# Altium schematic sheet Memory.SchDoc: QSPI
size A4; SheetNumber: 3; SheetTotal: 5; Time: C2S Memory
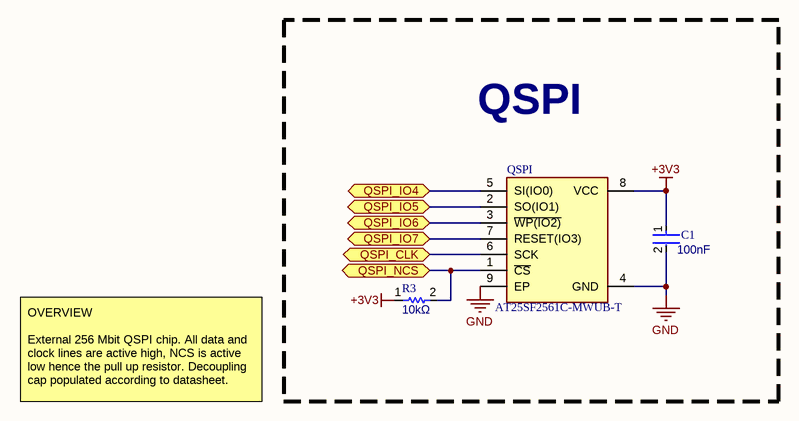
[diagram p0: Memory.SchDoc]

## Parts
C1  value 100nF  [FP-GCM188-0_1-IPC_B]  (hidden comment: GCM188L81H104MA57D)
QSPI  AT25SF2561C-MWUB-T  [SON127P800X600X80-9N-D]
R3  value 10kΩ  [FP-CRCW0603-e3-IPC_C]  (hidden comment: CRCW060310K0FKED)

## Blocks framed on the sheet
QSPI: C1 QSPI R3

## Ports
QSPI_CLK (bidir), QSPI_IO4 (bidir), QSPI_IO5 (bidir), QSPI_IO6 (bidir), QSPI_IO7 (bidir), QSPI_NCS (bidir)

## Nets
+3V3: C1.1 QSPI.8(VCC) R3.1
GND: C1.2 QSPI.4(GND) QSPI.9(EP)
QSPI_CLK: QSPI.6(SCK) ; port QSPI_CLK
QSPI_IO4: QSPI.5(SI(IO0)) ; port QSPI_IO4
QSPI_IO5: QSPI.2(SO(IO1)) ; port QSPI_IO5
QSPI_IO6: QSPI.3(~{WP(IO2)}) ; port QSPI_IO6
QSPI_IO7: QSPI.7(RESET(IO3)) ; port QSPI_IO7
QSPI_NCS: QSPI.1(~{CS}) R3.2 ; port QSPI_NCS

## Notes on the sheet
- OVERVIEW
  External 256 Mbit QSPI chip. All data and clock lines are active high, NCS is active low hence the pull up resistor. Decoupling cap populated according to datasheet.
- Title:
- Version:
- Revision:
- Perth Aerospace Student Team
- Size:
- Date:
- A4
- Project:
- Sheet
- of
- Author:
- Approved By:
- Curtin University
- Kent Street, Bentley
- Western Australia, 6152
- File:

## Library data of the parts
C1 = CMP-001-00108-1: Cap Ceramic 0.1uF 50V X8L 20% Pad SMD 0603 150C Automotive T/R; Manufacturer Lifecycle Status: IN PRODUCTION; Added By: Felix; Country of Origin: Philippines; Number of Terminals: 2; Max Operating Temperature: 150°C; Tolerance: 20%; Harmonized Tariff Schedule (HTS) Code: 8532.24.00.20; Length: 1.6mm; Thickness: 800µm; Export Control Classification Number (ECCN) Code: EAR99; Voltage Rating (DC): 50V; Mounting Technology: Surface Mount; Dielectric Material: Ceramic; Height: 800µm; Lifecycle Status: Production; Material: Ceramic; Introduction Date: 2013-11-20; Voltage Rating: 50V; Width: 800µm; RoHS: Compliant; REACH SVHC: Yes; Min Operating Temperature: -55°C; Case/Package: 0603
QSPI = CMP-181-000004-3: Integrated Circuit; Manufacturer_Name: Renesas Electronics; Imported By: Felix; Source: C2Sv0.1.SchLib; Manufacturer_Part_Number: AT25SF2561C-MWUB-T; Height: 0.8mm; Design Item ID: AT25SF2561C-MWUB-T; Datasheet Link: https://www.renesas.com/us/en/products/memory-logic/non-volatile-memory/spi-nor-flash/at25sf2561c-256mbit-3v-spi-serial-flash-memory-single-dual-quad-io-qpi-and-dtr-support
R3 = CMP-009-00205-3: Resistor; Temperature Coefficient: 100ppm/°C; Working Voltage: 75V; Power Dissipation: 100mW; Added By: Felix; Tolerance: 1%; Max Operating Temperature: 155°C; Width: 850µm; Composition: Thick Film; Mounting Technology: Surface Mount; Number of Terminations: 2; Height: 450µm; Number of Terminals: 2; RoHS: Compliant; Power Rating: 100mW; Harmonized Tariff Schedule (HTS) Code: 8533.21.00.30; Case/Package: 0603; Export Control Classification Number (ECCN) Code: EAR99; Introduction Date: 2003-05-01; REACH SVHC: Yes; Lead Free: Lead Free; Features: Automotive AEC-Q200; Min Operating Temperature: -55°C; Voltage Rating: 75V; Country of Origin: Israel, Taiwan; Lifecycle Status: Production; Max Power Dissipation: 100mW; Length: 1.55mm; Packaging: Tape & Reel (TR); China RoHS: Non-Compliant